# Altium project SW6306_CCAA_EVB_V0.2(20231010 ).PrjPcb
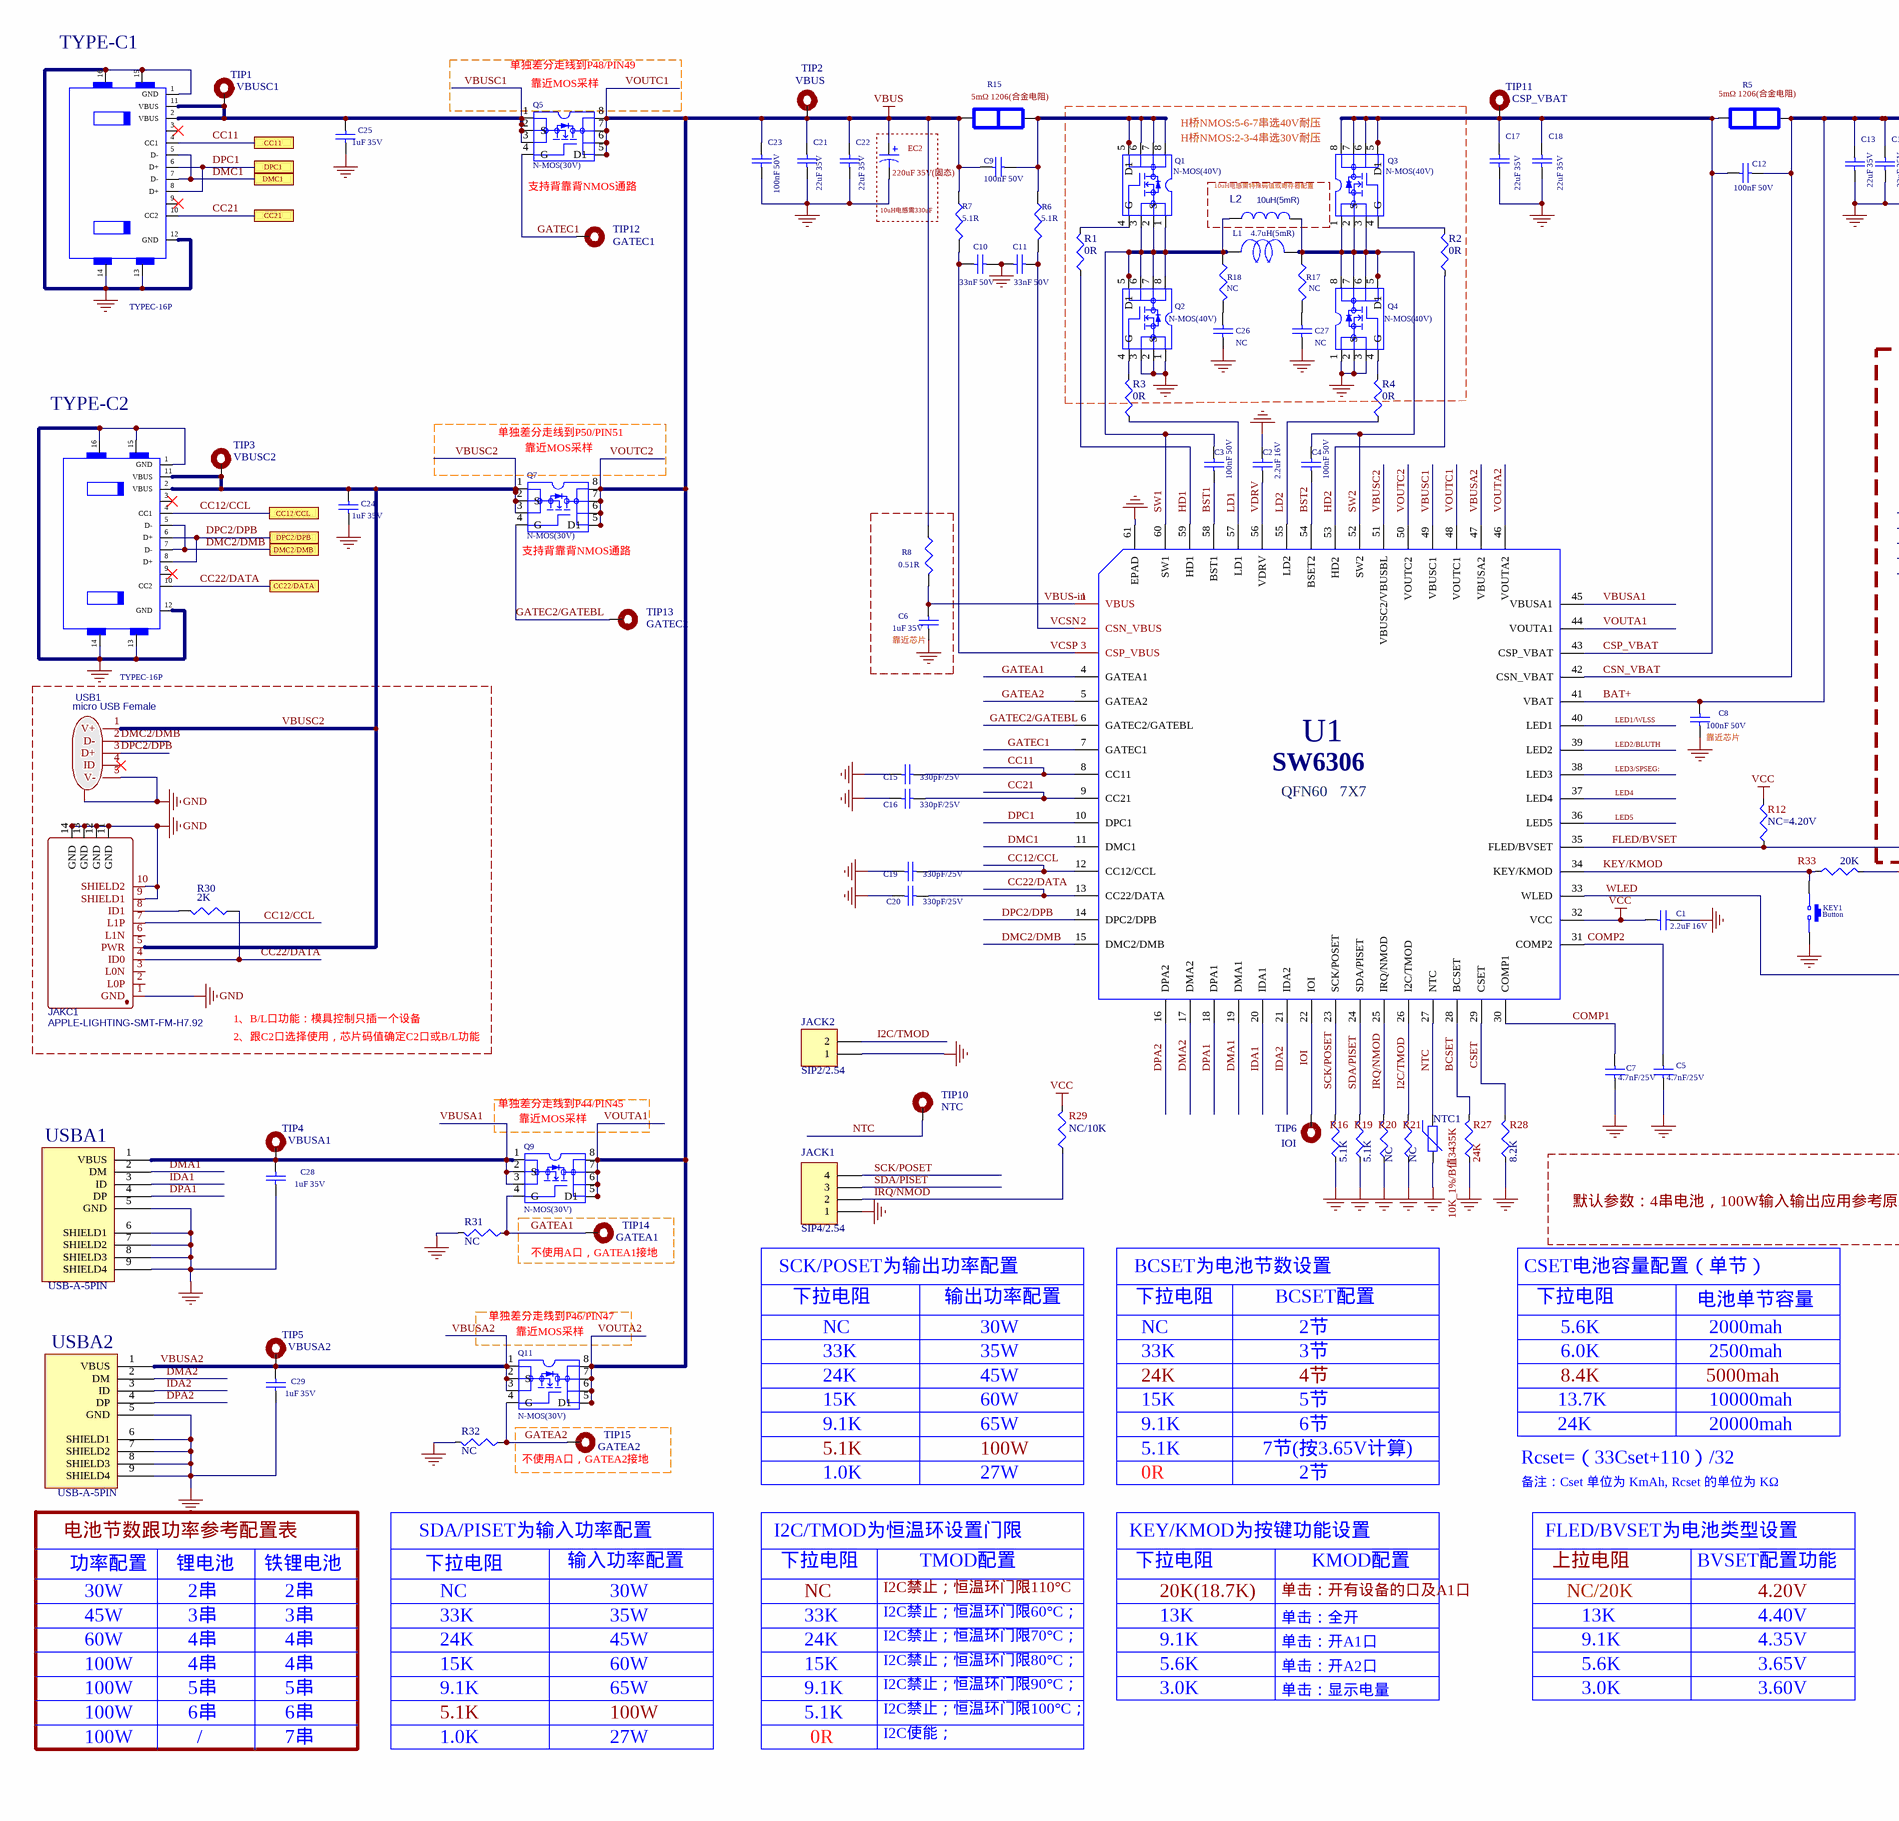
[diagram p0: SW6306_CCAA_EVB_V0.2(20231010 ).SchDoc, left]
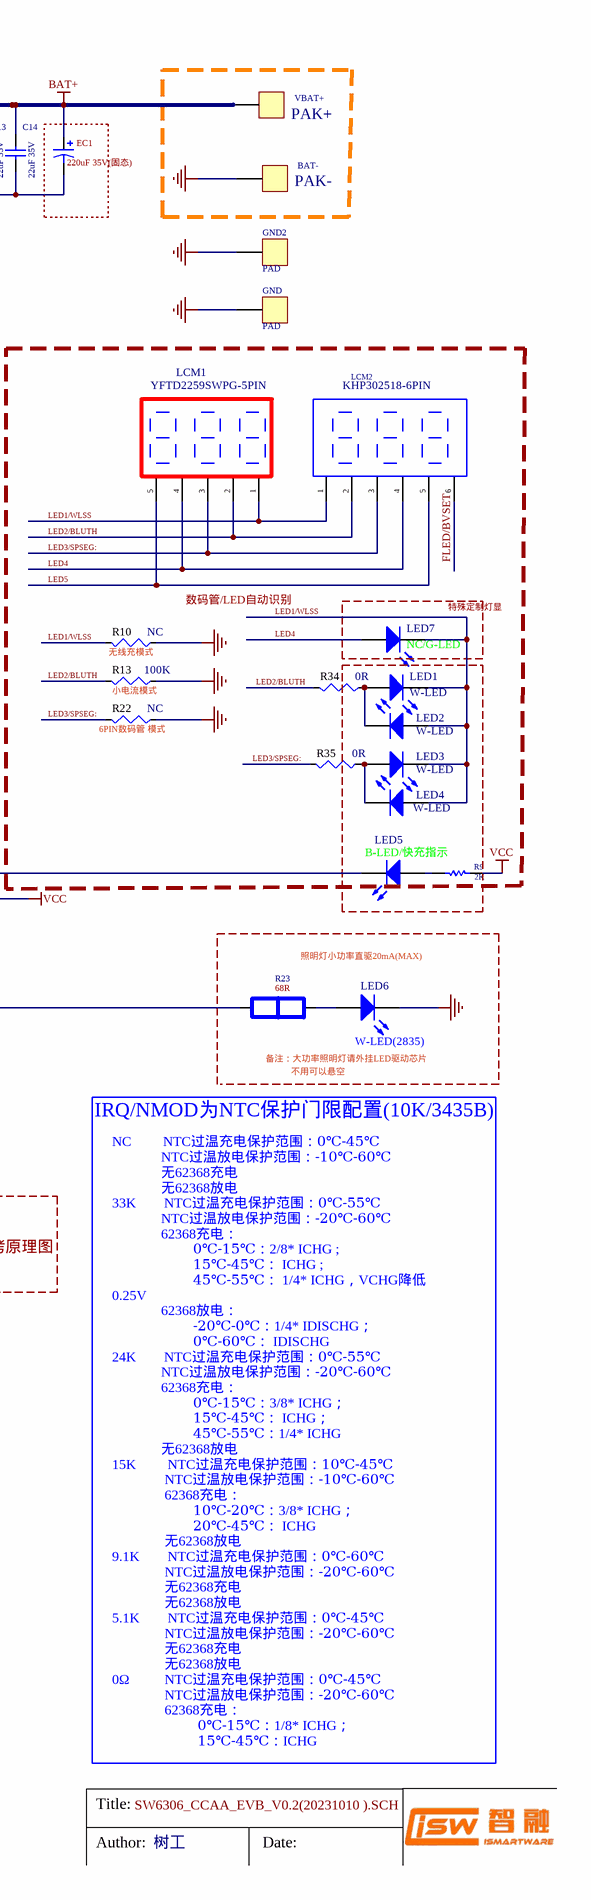
[diagram p1: SW6306_CCAA_EVB_V0.2(20231010 ).SchDoc, right]
1 sheet, 107 parts. Net scope: flat (ports and power ports of the same name join across sheets).
Board file: SW6306_CCAA_EVB_V0.2(20231010 ).PcbDoc

## Sheet SW6306_CCAA_EVB_V0.2(20231010 ).SchDoc
size 508 x 381 mm; SheetNumber: 1; SheetTotal: 1

### Parts
BAT-  PAK-  [BAT-PAD]
C1  2.2uF 16V  [C 0603]
C2  2.2uF 16V  [C 0603]
C3  100nF 50V  [C 0603]
C4  100nF 50V  [C 0603]
C5  4.7nF/25V  [C 0603]
C6  1uF 35V  [C 0603]
C7  4.7nF/25V  [C 0603]
C8  100nF 50V  [C 0603]
C9  100nF 50V  [C 0603]
C10  33nF 50V  [C 0603]
C11  33nF 50V  [C 0603]
C12  100nF 50V  [C 0603]
C13  22uF 35V  [C 0805]
C14  22uF 35V  [C 0805]
C15  330pF/25V  [C 0603]
C16  330pF/25V  [C 0603]
C17  22uF 35V  [C 0805]
C18  22uF 35V  [C 0805]
C19  330pF/25V  [C 0603]
C20  330pF/25V  [C 0603]
C21  22uF 35V  [C 0805]
C22  22uF 35V  [C 0805]
C23  100nF 50V  [C 0603]
C24  1uF 35V  [C 0805]
C25  1uF 35V  [C 0805]
C26  NC  [C 0603]
C27  NC  [C 0603]
C28  1uF 35V  [C 0805]
C29  1uF 35V  [C 0805]
EC1  220uF 35V(固态)  [EC-6.3]
EC2  220uF 35V(固态)  [EC-6.3]
GND  PAD  [BAT-PAD]
GND2  PAD  [BAT-PAD]
JACK1  SIP4/2.54  [HDR1X4]
JACK2  SIP2/2.54  [PIN2]
JAKC1  APPLE-LIGHTING-SMT-FM-H7.92  [Lightning]
KEY1  Button  [SW-SMD-6x3.5]
L1  4.7uH(5mR)  [L 12×12]
L2  10uH(5mR)  [L_环形电感_13mm]
LCM1  YFTD2259SWPG-5PIN  [LED_5PIN  12*8*4.5mm]
LCM2  KHP302518-6PIN  [LED_188_6PIN]
LED1  W-LED  [LED_0603]
LED2  W-LED  [LED_0603]
LED3  W-LED  [LED_0603]
LED4  W-LED  [LED_0603]
LED5  B-LED/快充指示  [LED_0603]
LED6  W-LED(2835)  [LED_2835]
LED7  NC/G-LED  [LED_0603]
NTC1  10K_1%/B值3435K  [R 1206]
Q1  N-MOS(40V)  [PDFN-3*3]
Q2  N-MOS(40V)  [PDFN-3*3]
Q3  N-MOS(40V)  [PDFN-3*3]
Q4  N-MOS(40V)  [PDFN-3*3]
Q5  N-MOS(30V)  [PDFN-3*3]
Q7  N-MOS(30V)  [PDFN-3*3]
Q9  N-MOS(30V)  [PDFN-3*3]
Q11  N-MOS(30V)  [PDFN-3*3]
R1  0R  [R 0603]
R2  0R  [R 0603]
R3  0R  [R 0603]
R4  0R  [R 0603]
R5  5mΩ 1206(合金电阻)  [R 1206]
R6  5.1R  [R 0603]
R7  5.1R  [R 0603]
R8  0.51R  [R 0603]
R9  2K  [R 0603]
R10  NC  [R 0603]
R12  NC=4.20V  [R 0603]
R13  100K  [R 0603]
R15  5mΩ 1206(合金电阻)  [R 1206]
R16  5.1K  [R 0603]
R17  NC  [R 0603]
R18  NC  [R 0603]
R19  5.1K  [R 0603]
R20  NC  [R 0603]
R21  NC  [R 0603]
R22  NC  [R 0603]
R23  68R  [R 0805]
R27  24K  [R 0603]
R28  8.2K  [R 0603]
R29  NC/10K  [R 0603]
R30  2K  [R 0603]
R31  NC  [R 0603]
R32  NC  [R 0603]
R33  20K  [R 0603]
R34  0R  [R 0603]
R35  0R  [R 0603]
TIP1  VBUSC1  [tip]
TIP2  VBUS  [tip]
TIP3  VBUSC2  [tip]
TIP4  VBUSA1  [tip]
TIP5  VBUSA2  [tip]
TIP6  IOI  [tip]
TIP10  NTC  [tip]
TIP11  CSP_VBAT  [tip]
TIP12  GATEC1  [tip]
TIP13  GATEC2  [tip]
TIP14  GATEA1  [tip]
TIP15  GATEA2  [tip]
TYPE-C1  TYPEC-16P  [USB-C_16P_M]
TYPE-C2  TYPEC-16P  [USB-C_16P_M]
U1  SW6306  [QFN-60_7X7X04P]
USB1  micro USB Female  [MICRO-USB-SMD_5P-P0.65-H-F_C10418]
USBA1  USB-A-5PIN  [USB-A_5P_SMD]
USBA2  USB-A-5PIN  [USB-A_5P_SMD]
VBAT+  PAK+  [BAT-PAD]

### Blocks framed on the sheet
10uH电感需330uF: EC2
10uH电感需特殊码值或寄存器配置: L2
数码管/LED自动识别: LCM1 LCM2 LED1-LED5 R9 R10 R13 R22 R34 R35
靠近芯片: C6 R8
特殊定制灯显: LED7
不使用A口，GATEA1接地: TIP14
不使用A口，GATEA2接地: TIP15

### Ports
CC11, CC12/CCL, CC21, CC22/DATA, DMC1, DMC2/DMB, DPC1, DPC2/DPB

### Nets
BAT+: C8.1 C12.1 C13.1 C14.1 EC1.1 R5.2 U1.41(VBAT) U1.42(CSN_VBAT) VBAT+.1(PAD)  [also labelled CSN_VBAT]
GND: BAT-.1(PAD) C1.1 C2.2 C5.2 C6.2 C7.2 C8.2 C10.1 C11.2 C13.2 C14.2 C15.2 C16.2 C17.2 C18.2 C19.2 C20.2 C21.2 C22.2 C23.2 C24.2 C25.2 C26.1 C27.1 C28.2 C29.2 EC1.2 EC2.2 GND.1(PAD) GND2.1(PAD) JACK1.1 JACK2.1 JAKC1.1(GND) JAKC1.9(SHIELD1) JAKC1.10(SHIELD2) JAKC1.11(GND) JAKC1.12(GND) JAKC1.13(GND) JAKC1.14(GND) KEY1.1 LED6.2(K) NTC1.2 Q2.1(S1) Q2.2(S) Q2.3(S3) Q4.1(S1) Q4.2(S) Q4.3(S3) R10.1 R13.1 R16.1 R19.1 R20.1 R21.1 R22.1 R27.1 R28.1 R31.2 R32.2 TYPE-C1.1(GND) TYPE-C1.12(GND) TYPE-C1.13 TYPE-C1.14 TYPE-C1.15 TYPE-C1.16 TYPE-C2.1(GND) TYPE-C2.12(GND) TYPE-C2.13 TYPE-C2.14 TYPE-C2.15 TYPE-C2.16 U1.61(EPAD) USB1.0(MTN) USB1.5(V-) USBA1.5(GND) USBA1.6(SHIELD1) USBA1.7(SHIELD2) USBA1.8(SHIELD3) USBA1.9(SHIELD4) USBA2.5(GND) USBA2.6(SHIELD1) USBA2.7(SHIELD2) USBA2.8(SHIELD3) USBA2.9(SHIELD4)
VCC: C1.2 R9.2 R12.2 R29.2 R33.2 U1.32(VCC)
VOUTA1: C9.2 C21.1 C22.1 C23.1 EC2.1 Q5.5(D1) Q5.6(D2) Q5.7(D3) Q5.8(D4) Q5.9(EPAD) Q7.5(D1) Q7.6(D2) Q7.7(D3) Q7.8(D4) Q7.9(EPAD) Q9.5(D1) Q9.6(D2) Q9.7(D3) Q9.8(D4) Q9.9(EPAD) Q11.5(D1) Q11.6(D2) Q11.7(D3) Q11.8(D4) Q11.9(EPAD) R7.1 R8.1 R15.1 TIP2.1 U1.44(VOUTA1) U1.46(VOUTA2) U1.48(VOUTC1) U1.50(VOUTC2)  [also labelled VBUS, VOUTA2, VOUTC1, VOUTC2]
BCSET: R27.2 U1.28(BCSET)
BST1: C3.1 U1.58(BST1)
BST2: C4.1 U1.54(BSET2)
CC11: C15.1 TYPE-C1.4(CC1) U1.8(CC11) ; port CC11
CC12/CCL: C19.1 JAKC1.7(L1P) TYPE-C2.4(CC1) U1.12(CC12/CCL) ; port CC12/CCL
CC21: C16.1 TYPE-C1.10(CC2) U1.9(CC21) ; port CC21
CC22/DATA: C20.1 JAKC1.4(ID0) R30.1 TYPE-C2.10(CC2) U1.13(CC22/DATA) ; port CC22/DATA
COMP1: C7.1 U1.30(COMP1)
COMP2: C5.1 U1.31(COMP2)
CSET: R28.2 U1.29(CSET)
CSP_VBAT: C12.2 C17.1 C18.1 Q3.5(D1) Q3.6(D2) Q3.7(D3) Q3.8(D4) Q3.9(EPAD) R5.1 TIP11.1 U1.43(CSP_VBAT)
DMA1: U1.19(DMA1) USBA1.2(DM)
DMA2: U1.17(DMA2) USBA2.2(DM)
DMC1: TYPE-C1.5(D-) TYPE-C1.7(D-) U1.11(DMC1) ; port DMC1
DMC2/DMB: TYPE-C2.5(D-) TYPE-C2.7(D-) U1.15(DMC2/DMB) USB1.2(D-) ; port DMC2/DMB
DPA1: U1.18(DPA1) USBA1.4(DP)
DPA2: U1.16(DPA2) USBA2.4(DP)
DPC1: TYPE-C1.6(D+) TYPE-C1.8(D+) U1.10(DPC1) ; port DPC1
DPC2/DPB: TYPE-C2.6(D+) TYPE-C2.8(D+) U1.14(DPC2/DPB) USB1.3(D+) ; port DPC2/DPB
FLED/BVSET: LCM2.6 LED5.2(K) R12.1 U1.35(FLED/BVSET)
GATEA1: Q9.4(G) R31.1 TIP14.1 U1.4(GATEA1)
GATEA2: Q11.4(G) R32.1 TIP15.1 U1.5(GATEA2)
GATEC1: Q5.4(G) TIP12.1 U1.7(GATEC1)
GATEC2/GATEBL: Q7.4(G) TIP13.1 U1.6(GATEC2/GATEBL)
HD1: R1.1 U1.59(HD1)
HD2: R2.1 U1.53(HD2)
I2C/TMOD: JACK2.2 R21.2 U1.26(I2C/TMOD)
IDA1: U1.20(IDA1) USBA1.3(ID)
IDA2: U1.21(IDA2) USBA2.3(ID)
IOI: TIP6.1 U1.22(IOI)
IRQ/NMOD: JACK1.2 R20.2 R29.1 U1.25(IRQ/NMOD)
KEY/KMOD: KEY1.2 R33.1 U1.34(KEY/KMOD)
LD1: R3.1 U1.57(LD1)
LD2: R4.1 U1.55(LD2)
LED1/WLSS: LCM1.1 LCM2.1 LED1.2(K) LED2.1(A) LED3.2(K) LED4.1(A) LED7.2(K) R10.2 U1.40(LED1)
LED2/BLUTH: LCM1.2 LCM2.2 R13.2 R34.2 U1.39(LED2)
LED3/SPSEG:: LCM1.3 LCM2.3 R22.2 R35.2 U1.38(LED3)
LED4: LCM1.4 LCM2.4 LED7.1(A) U1.37(LED4)
LED5: LCM1.5 LCM2.5 U1.36(LED5)
NTC: NTC1.1 TIP10.1 U1.27(NTC)
SCK/POSET: JACK1.4 R16.2 U1.23(SCK/POSET)
SDA/PISET: JACK1.3 R19.2 U1.24(SDA/PISET)
SW1: C3.2 L1.2 L2.1 Q1.1(S1) Q1.2(S) Q1.3(S3) Q2.5(D1) Q2.6(D2) Q2.7(D3) Q2.8(D4) Q2.9(EPAD) R18.1 U1.60(SW1)
SW2: C4.2 L1.1 L2.2 Q3.1(S1) Q3.2(S) Q3.3(S3) Q4.5(D1) Q4.6(D2) Q4.7(D3) Q4.8(D4) Q4.9(EPAD) R17.1 U1.52(SW2)
VBUS-in: C6.1 R8.2 U1.1(VBUS)
VBUSA1: C28.1 Q9.1(S1) Q9.2(S) Q9.3(S3) TIP4.1 U1.45(VBUSA1) USBA1.1(VBUS)
VBUSA2: C29.1 Q11.1(S1) Q11.2(S) Q11.3(S3) TIP5.1 U1.47(VBUSA2) USBA2.1(VBUS)
VBUSC1: C25.1 Q5.1(S1) Q5.2(S) Q5.3(S3) TIP1.1 TYPE-C1.2(VBUS) TYPE-C1.11(VBUS) U1.49(VBUSC1)
VBUSC2: C24.1 JAKC1.5(PWR) Q7.1(S1) Q7.2(S) Q7.3(S3) TIP3.1 TYPE-C2.2(VBUS) TYPE-C2.11(VBUS) U1.51(VBUSC2/VBUSBL) USB1.1(V+)
VCSN: C11.1 R6.2 U1.2(CSN_VBUS)
VCSP: C10.2 R7.2 U1.3(CSP_VBUS)
VDRV: C2.1 U1.56(VDRV)
WLED: R23.2 U1.33(WLED)
NetC9_1: C9.1 Q1.5(D1) Q1.6(D2) Q1.7(D3) Q1.8(D4) Q1.9(EPAD) R6.1 R15.2
NetC26_2: C26.2 R18.2
NetC27_2: C27.2 R17.2
NetJAKC1_8: JAKC1.8(ID1) R30.2
NetLED1_1: LED1.1(A) LED2.2(K) R34.1
NetLED3_1: LED3.1(A) LED4.2(K) R35.1
NetLED5_1: LED5.1(A) R9.1
NetLED6_1: LED6.1(A) R23.1
NetQ1_4: Q1.4(G) R1.2
NetQ2_4: Q2.4(G) R3.2
NetQ3_4: Q3.4(G) R2.2
NetQ4_4: Q4.4(G) R4.2

Not connected (* = marked no-connect by the designer): JAKC1 2(L0P) 3(L0N) 6(L1N); TYPE-C1 3* 9*; TYPE-C2 3* 9*; USB1 4(ID)*

### Notes on the sheet
- (near Q5) 单独差分走线到P48/PIN49
- (near Q5) 靠近MOS采样
- (near Q1) H桥NMOS:5-6-7串选40V耐压
- 支持背靠背NMOS通路
- (near Q1) H桥NMOS:2-3-4串选30V耐压
- 单独差分走线到P50/PIN51
- (near Q7) 靠近MOS采样
- (near Q7) 支持背靠背NMOS通路
- (near R10) 无线充模式
- (near R13) 小电流模式
- (near C8) 靠近芯片
- (near R22) 6PIN数码管 模式
- (near U1) QFN60   7X7
- 照明灯小功率直驱20mA(MAX)
- 1、B/L口功能：模具控制只插一个设备
- 2、跟C2口选择使用，芯片码值确定C2口或B/L功能
- 备注：大功率照明灯请外挂LED驱动芯片
- 不用可以悬空
- 单独差分走线到P44/PIN45
- IRQ/NMOD为NTC保护门限配置(10K/3435B)
- (near Q9) 靠近MOS采样
- 默认参数：4串电池，100W输入输出应用参考原理图
- (near JACK1) SCK/POSET为输出功率配置
- BCSET为电池节数设置
- CSET电池容量配置（单节）
- (near Q11) 单独差分走线到P46/PIN47
- (near Q11) 靠近MOS采样
- 下拉电阻
- NC
- 输出功率配置
- 30W
- BCSET配置
- 2节
- 5.6K
- 电池单节容量
- 2000mah
- 33K
- 24K
- 15K
- 35W
- 45W
- 60W
- 3节
- 4节
- 5节
- 13.7K
- 6.0K
- 8.4K
- 5000mah
- 10000mah
- 2500mah
- 9.1K
- 5.1K
- 65W
- 100W
- 7节(按3.65V计算)
- 6节
- Rcset=（33Cset+110）/32
- 20000mah
- 1.0K
- 27W
- 0R
- 备注：Cset 单位为 KmAh, Rcset 的单位为 KΩ
- (near USBA2) 电池节数跟功率参考配置表
- 功率配置
- 锂电池
- 铁锂电池
- SDA/PISET为输入功率配置
- 输入功率配置
- I2C/TMOD为恒温环设置门限
- I2C禁止；恒温环门限110°C
- TMOD配置
- KEY/KMOD为按键功能设置
- 单击：开有设备的口及A1口
- KMOD配置
- FLED/BVSET为电池类型设置
- 上拉电阻
- BVSET配置功能
- 2串
- 3串
- 4串
- I2C禁止；恒温环门限60°C；
- I2C禁止；恒温环门限70°C；
- 20K(18.7K)
- 13K
- 单击：全开
- 单击：开A1口
- NC/20K
- 4.20V
- 4.40V
- 4.35V
- 5串
- I2C禁止；恒温环门限80°C；
- I2C禁止；恒温环门限90°C；
- I2C禁止；恒温环门限100°C；
- 3.0K
- 单击：开A2口
- 单击：显示电量
- 3.65V
- 3.60V
- NC         NTC过温充电保护范围：0℃-45℃
  NTC过温放电保护范围：-10℃-60℃
  无62368充电
  无62368放电
  33K        NTC过温充电保护范围：0℃-55℃
  NTC过温放电保护范围：-20℃-60℃
  62368充电：
  0℃-15℃：2/8* ICHG ;
  15℃-45℃： ICHG ;
  45℃-55℃： 1/4* ICHG，VCHG降低0.25V
  62368放电：
  -20℃-0℃：1/4* IDISCHG；
  0℃-60℃： IDISCHG
  24K        NTC过温充电保护范围：0℃-55℃
  NTC过温放电保护范围：-20℃-60℃
  62368充电：
  0℃-15℃：3/8* ICHG；
  15℃-45℃： ICHG；
  45℃-55℃：1/4* ICHG
  无62368放电
  15K         NTC过温充电保护范围：10℃-45℃
  NTC过温放电保护范围：-10℃-60℃
  62368充电：
  10℃-20℃：3/8* ICHG；
  20℃-45℃： ICHG
  无62368放电
  9.1K        NTC过温充电保护范围：0℃-60℃
  NTC过温放电保护范围：-20℃-60℃
  无62368充电
  无62368放电
  5.1K        NTC过温充电保护范围：0℃-45℃
  NTC过温放电保护范围：-20℃-60℃
  无62368充电
  无62368放电
  0Ω          NTC过温充电保护范围：0℃-45℃
  NTC过温放电保护范围：-20℃-60℃
  62368充电：
  0℃-15℃：1/8* ICHG；
  15℃-45℃：ICHG
  无62368放电
- 6串
- /
- 7串
- I2C使能；
- Title:
- Author:
- SW6306_CCAA_EVB_V0.2(20231010 ).SCH
- 树工
- Date:

### Library data of the parts
BAT- VBAT+ = PAD: 电池包焊盘
C1-C25 C28 C29 = Capacitor: 贴片电容
C26 C27 = 0603 1nF (102) 10% 50V: 贴片电容; ComponentLink1Description: 供应商链接; ComponentLink1URL: http://www.szlcsc.com/product/details_1940.html; Package: 0603; Supplier: LC; SuppliersPartNumber: C1588; value: NC
EC1 EC2 = Capacitor-E: 固态电容
GND GND2 = PAD: 单独焊盘
JACK1 = Header 4: 排针： 4Pin/2.54; LatestRevisionDate: 17-Jul-2002; LatestRevisionNote: Re-released for DXP Platform.; Publisher: Altium Limited
JACK2 = Header 2H: Header, 2-Pin, Right Angle; LatestRevisionDate: 17-Jul-2002; LatestRevisionNote: Re-released for DXP Platform.; Publisher: Altium Limited
JAKC1 = APPLE-LIGHTING-SMT-FM-H7.92: 苹果L插座; BOM_Manufacturer: LCSC; 物料编码: 01.16.01.0008; BOM_Supplier: LCSC; BOM_Supplier Part: C168722; BOM_Manufacturer Part: APPLE-LIGHTING-SMT-FM-H7.92; Contributor: LCSC; spicePre: U; spiceSymbolName: APPLE-LIGHTING-SMT-FM-H7.92
KEY1 = SW: 贴片按键; VALUE: R_VOL+; VALUE2: #; PCB DECAL: SW_3X6X3.5MM-DIP
L1 = Inductors: 贴片电感
L2 = INDUCTOR: 插件环形电感; Value: 22uH; Footprint: INDUCTOR_15mm2
LCM1 = LED_888_5PIN: 5PIN数码管:12*8*4.2
LCM2 = LED-888_6PIN: 6PIN数码管:15.3*8.15*5; PCB DECAL: LED_YFTD2259SWPG-6X1.78-1.28MM
LED1-LED7 = Diode-LED: 贴片LED灯
NTC1 = Res Varistor: 热敏电阻
Q1-Q5 Q7 Q9 Q11 = MOSFET-PDFN: SWT30N50
R1-R4 R10 R12 R13 R16 R19-R22 R27-R29 R31-R35 = Resistance: 贴片电阻
R5 R15 = resistance-1W: 合金电阻
R6 R7 R17 R18 = 0603 1KΩ (1001) 1%: 贴片电阻; ComponentLink1Description: 供应商链接; ComponentLink1URL: http://www.szlcsc.com/product/details_21904.html; Package: 0603; Supplier: LC; SuppliersPartNumber: C21190
  R6 R7: value: 5.1R
  R17 R18: value: NC
R8 = 0603 1KΩ (1001) 1%: 贴片电阻; value: 5.1R; ComponentLink1Description: 供应商链接; ComponentLink1URL: http://www.szlcsc.com/product/details_21904.html; Package: 0603; Supplier: LC; SuppliersPartNumber: C21190
R9 = RES: 贴片电阻; PCB_DECAL: R-0603; PCB DECAL: R0603; LatestRevisionDate: 17-Jul-2002; PackageReference: AXIAL-0.3; Publisher: PADS; PackageDescription: Axial Device, Thru-Hole; 2 Leads; 0.3 in Pin Spacing; Value: 2k
R23 = resistance-1W: 贴片电阻
R30 = ?k/1%/0603: 贴片电阻; 物料编码: 01.06.01.00xx; 封装: 0603_R
TIP1-TIP6 TIP10-TIP15 = TIP: 测试点
TYPE-C1 TYPE-C2 = TYPEC-16P: TYPE-C-16PIN插座; Value: TYPE-C; PCB DECAL: TYPE-C-16P
U1 = ZR2069-QFN60_7x7_AACC: 芯片
USB1 = micro USB Female: USB-Micro B插座; BOM_Manufacturer: ValuePro; 物料编码: 01.16.01.0001; BOM_Supplier: LCSC; BOM_Manufacturer Part: micro USBFemale; image: //image.lceda.cn/szlcsc/C10418.jpg; BOM_Supplier Part: C10418; spicePre: U; spiceSymbolName: micro USBFemale
USBA1 USBA2 = TYPEA-ID: USB-A 5PIN座